# EAGLE design ControllerV1 (EAGLE 5.06)
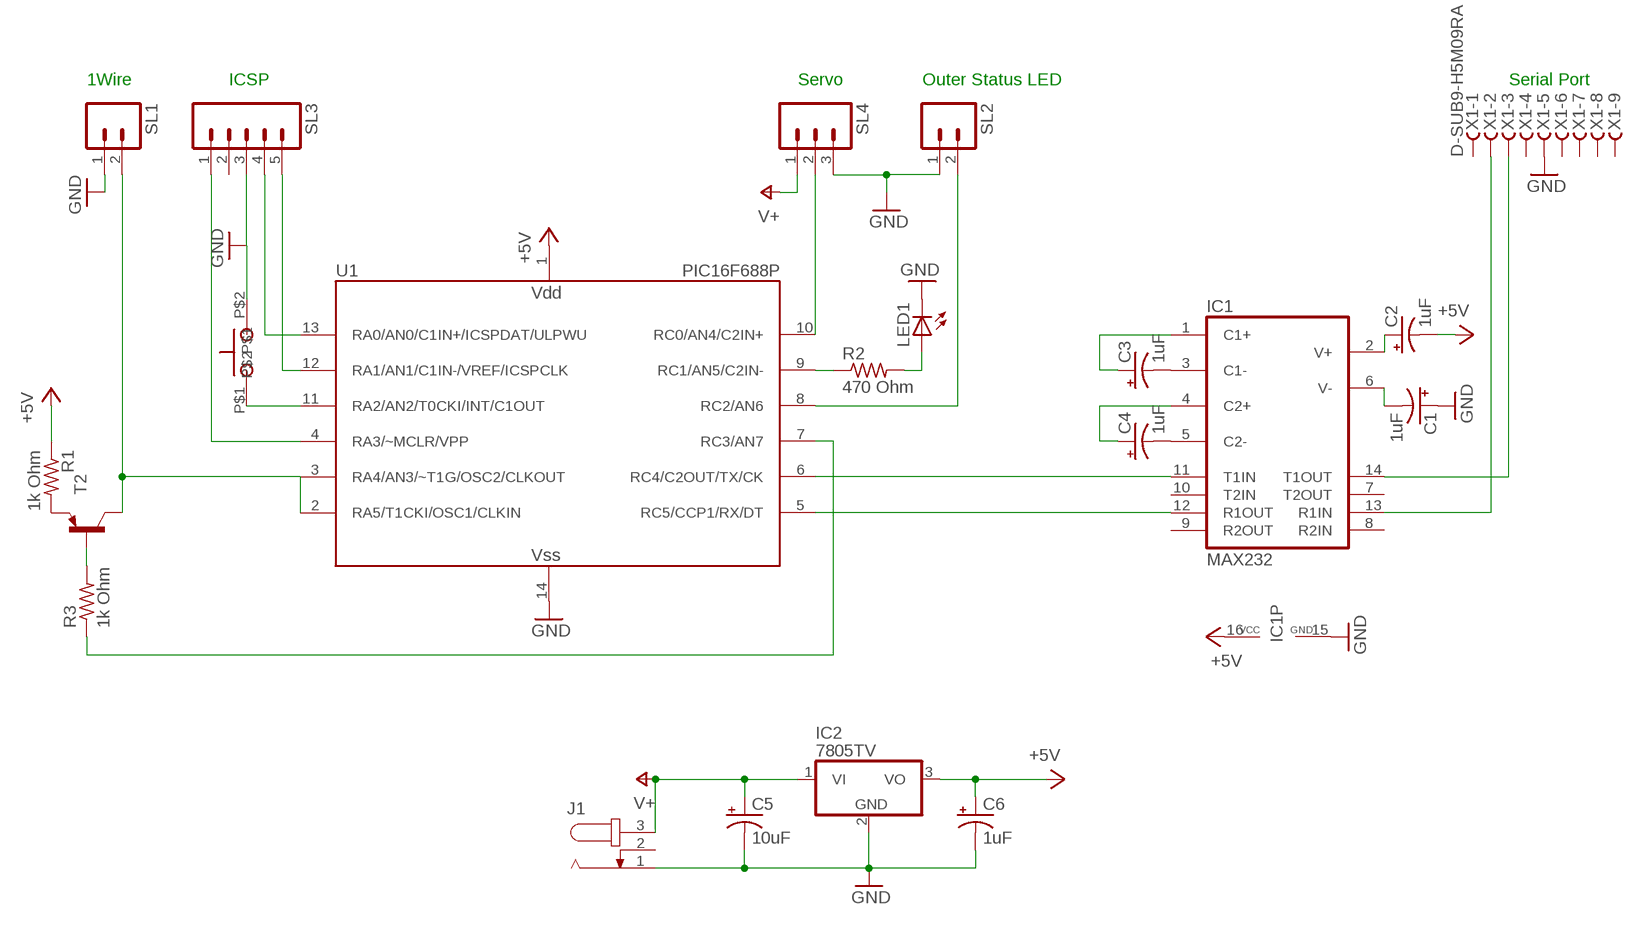
[diagram p0: schematic, sheet 1]

## Parts
C1  1uF  CPOL-USE2.5-5  [E2,5-5]
C2  1uF  CPOL-USE2.5-5  [E2,5-5]
C3  1uF  CPOL-USE2.5-5  [E2,5-5]
C4  1uF  CPOL-USE2.5-5  [E2,5-5]
C5  10uF  CPOL-USE2.5-5  [E2,5-5]
C6  1uF  CPOL-USE2.5-5  [E2,5-5]
IC1  MAX232  [DIL16]
IC2  7805TV  [TO220V]
J1  JACK-PLUG1  [SPC4078]
LED1  LED5MM  [LED5MM]
R1  1k Ohm  R-US_0207/10  [0207/10]
R2  470 Ohm  R-US_0207/10  [0207/10]
R3  1k Ohm  R-US_0207/10  [0207/10]
SL1  M02  [02P]
SL2  M02  [02P]
SL3  M05  [05P]
SL4  M03  [03P]
T2  BC327-16-PNP-TO92-EBC  [TO92-EBC]
U1  PIC16F688P  [DIP-14]
U$1  SWITCH  [SWITCH]
X1  D-SUB9-H5M09RA  [H5M09RA]

## Nets
+5V: C2.- C6.+ IC1.16(VCC) IC2.3(VO) R1.1 U1.1(VDD)
GND: C1.+ C5.- C6.- IC1.15(GND) IC2.2(GND) J1.1 LED1.K(C) SL1.1 SL2.1 SL3.3 SL4.3 U1.14(VSS) U$1.P$2 X1.5
N$1: R1.2 T2.E
N$2: R2.1 U1.9(RC1/AN5/C2IN-)
N$3: SL2.2 U1.8(RC2/AN6)
N$4: IC1.12(R1OUT) U1.5(RC5/CCP1/RX/DT)
N$5: IC1.11(T1IN) U1.6(RC4/C2OUT/TX/CK)
N$6: SL3.1 U1.4(RA3/~MCLR/VPP)
N$7: SL3.4 U1.13(RA0/AN0/C1IN+/ICSPDAT/ULPWU)
N$8: SL3.5 U1.12(RA1/AN1/C1IN-/VREF/ICSPCLK)
N$9: LED1.A R2.2
N$10: U1.11(RA2/AN2/T0CKI/INT/C1OUT) U$1.P$1
N$11: IC1.13(R1IN) X1.2
N$12: IC1.14(T1OUT) X1.3
N$13: C2.+ IC1.2(V+)
N$14: C1.- IC1.6(V-)
N$15: C4.- IC1.5(C2-)
N$16: C3.- IC1.3(C1-)
N$17: C4.+ IC1.4(C2+)
N$18: C3.+ IC1.1(C1+)
N$19: SL4.2 U1.10(RC0/AN4/C2IN+)
N$20: R3.1 U1.7(RC3/AN7)
N$21: SL1.2 T2.C U1.2(RA5/T1CKI/OSC1/CLKIN) U1.3(RA4/AN3/~T1G/OSC2/CLKOUT)
N$22: R3.2 T2.B
V+: C5.+ IC2.1(VI) J1.3 SL4.1
Unconnected: IC1.7(T2OUT) IC1.8(R2IN) IC1.9(R2OUT) IC1.10(T2IN) J1.2 SL3.2 X1.1 X1.4 X1.6 X1.7 X1.8 X1.9

## Notes on the sheet
- 1Wire | ICSP | Servo | Outer Status LED | Serial Port

## Library data of the parts
C1-C6 = resistor:CPOL-US: POLARIZED CAPACITOR, American symbol
IC1 = maxim:MAX232: RS232 TRANSEIVER
IC2 = linear:78*: Positive VOLTAGE REGULATOR Source: http://cache.national.com/ds/LM/LM78L05.pdf http://www.fairchildsemi.com/ds/LM/LM7805.pdf
J1 = con-jack:JACK-PLUG: DC POWER JACK Power Jack, DC, Right Angle, Through Hole, Rated 5A at 16VDC, PC Terminals Distributor: Farnell (www.Farnell.de) Drawing: 84N1161.pdf / 84N1162.pdf Manufacturer: SPC Technology (www.spctechnology.com) Type: SPC4077 / SPC 4078
LED1 = led:LED: LED OSRAM: - CHIPLED LG R971, LG N971, LY N971, LG Q971, LY Q971, LO R971, LY R971 LH N974, LH R974 LS Q976, LO Q976, LY Q976 LO Q996 - Hyper CHIPLED LW Q18S LB Q993, LB Q99A, LB R99A - SideLED LS A670, LO A670, LY A670, LG A670, LP A670 LB A673, LV A673, LT A673, LW A673 LH A674 LY A675 LS A676, LA A676, LO A676, LY A676, LW A676 LS A679, LY A679, LG A679 - Hyper Micro SIDELED® LS Y876, LA Y876, LO Y876, LY Y876 LT Y87S - SmartLED LW L88C, LW L88S LB L89C, LB L89S, LG L890 LS L89K, LO L89K, LY L89K LS L896, LA L896, LO L896, LY L896 - TOPLED LS T670, LO T670, LY T670, LG T670, LP T670 LSG T670, LSP T670, LSY T670, LOP T670, LYG T670 LG T671, LOG T671, LSG T671 LB T673, LV T673, LT T673, LW T673 LH T674 LS T676, LA T676, LO T676, LY T676, LB T676, LH T676, LSB T676, LW T676 LB T67C, LV T67C, LT T67C, LS T67K, LO T67K, LY T67K, LW E67C LS E67B, LA E67B, LO E67B, LY E67B, LB E67C, LV E67C, LT E67C LW T67C LS T679, LY T679, LG T679 LS T770, LO T770, LY T770, LG T770, LP T770 LB T773, LV T773, LT T773, LW T773 LH T774 LS E675, LA E675, LY E675, LS T675 LS T776, LA T776, LO T776, LY T776, LB T776 LHGB T686 LT T68C, LB T68C - Hyper Mini TOPLED® LB M676 - Mini TOPLED Santana® LG M470 LS M47K, LO M47K, LY M47K Source: http://www.osram.convergy.de LUXEON: - LUMILED® LXK2-PW12-R00, LXK2-PW12-S00, LXK2-PW14-U00, LXK2-PW14-V00 LXK2-PM12-R00, LXK2-PM12-S00, LXK2-PM14-U00 LXK2-PE12-Q00, LXK2-PE12-R00, LXK2-PE12-S00, LXK2-PE14-T00, LXK2-PE14-U00 LXK2-PB12-K00, LXK2-PB12-L00, LXK2-PB12-M00, LXK2-PB14-N00, LXK2-PB14-P00, LXK2-PB14-Q00 LXK2-PR12-L00, LXK2-PR12-M00, LXK2-PR14-Q00, LXK2-PR14-R00 LXK2-PD12-Q00, LXK2-PD12-R00, LXK2-PD12-S00 LXK2-PH12-R00, LXK2-PH12-S00 LXK2-PL12-P00, LXK2-PL12-Q00, LXK2-PL12-R00 Source: www.luxeon.com KINGBRIGHT: KA-3528ASYC Source: www.kingbright.com
R1-R3 = resistor:R-US_: RESISTOR, American symbol
SL1 SL2 = con-amp-quick:M02: AMP QUICK CONNECTOR
SL3 = con-amp-quick:M05: AMP QUICK CONNECTOR
SL4 = con-amp-quick:M03: AMP QUICK CONNECTOR
T2 = transistor:*-PNP-: PNP Transistror
U1 = microchip2:PIC16F688: Microchip PIC16F688 14-pin 8-bit Flash microcontroller with nanoWatt Technology 4096 words program memory, 256 bytes RAM, 256 bytes EEPROM 12 I/O, 8 10-bit A/D, 2 comparators, 1 8-bit timer, 1 16-bit timer, ULPWU, EUSART
U$1 = button:SWITCH
X1 = con-thomas-betts:D-SUB9-: D-Subminiatur Connector Source: Electronioc Interconnects European Edition 1998

## Board
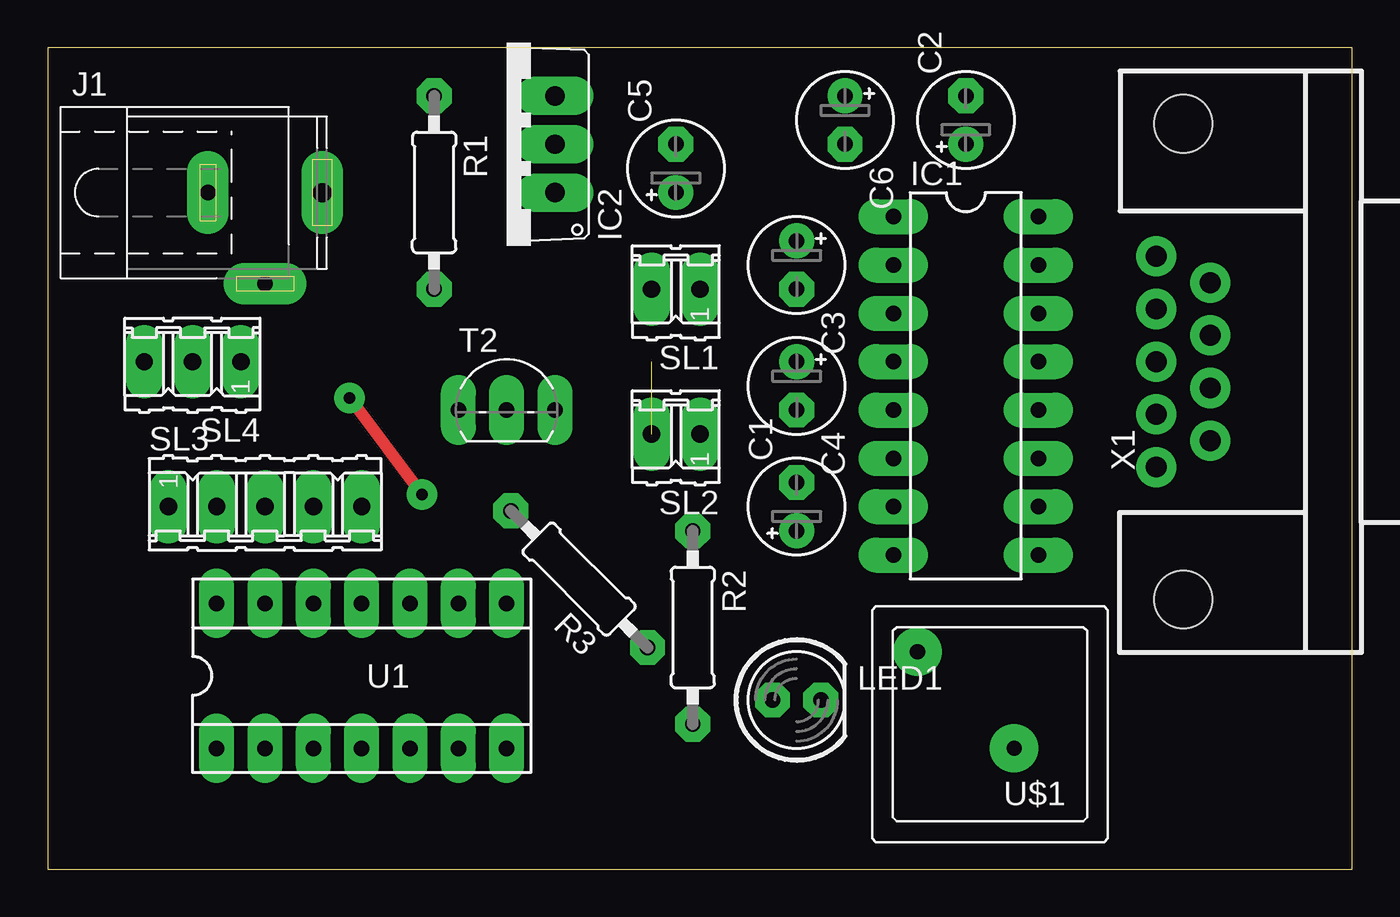
[diagram p1: board, top side]
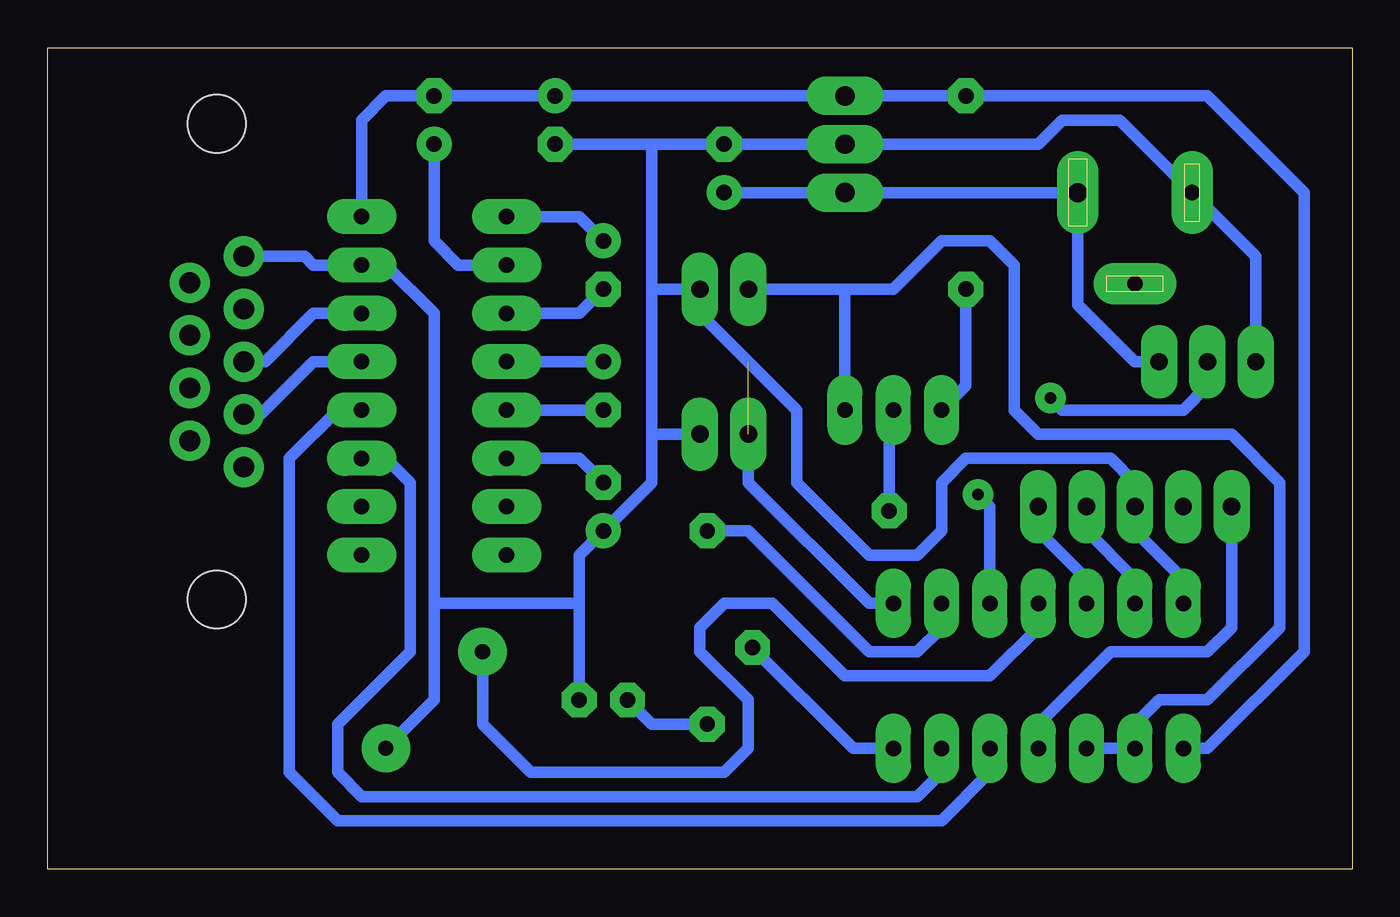
[diagram p2: board, bottom side, seen from below]

Size 68.58 x 43.18 mm. Coordinates in mm from the lower left corner, seen from the top.
Outline: 68.58,0 68.58,43.18 0,43.18 0,0 68.58,0
Copper layers (1*16): Top 0.035mm / dielectric 1.5mm / Bottom 0.035mm
Design rules "default *": minimum track width 24mil, minimum drill 24mil, track to track 8mil, track to pad 8mil, pad to pad 8mil, via to via 8mil, smd to smd 8mil, copper to edge 40mil, drill to drill 8mil, minimum pad ring 20mil, minimum via ring 20mil, stop-mask expansion 4mil, vias tented up to drill 0mil, thermal gap 10mil

### Footprints (pad centres in the part's own frame; a part is rotated, then mirrored left to right if it is on the bottom)
E2,5-5 = drill 0.813 pad 1.6 round: + -1.27,0 | drill 0.813 pad 1.6 octagon: - 1.27,0
DIL16 = drill 0.813 long: 1 -8.89,-3.81; 2 -6.35,-3.81; 3 -3.81,-3.81; 4 -1.27,-3.81; 5 1.27,-3.81; 6 3.81,-3.81; 7 6.35,-3.81; 8 8.89,-3.81; 9 8.89,3.81; 10 6.35,3.81; 11 3.81,3.81; 12 1.27,3.81; 13 -1.27,3.81; 14 -3.81,3.81; 15 -6.35,3.81; 16 -8.89,3.81
TO220V = drill 1.016 long: 1 -2.54,-2.54; 2 0,-2.54; 3 2.54,-2.54
SPC4078 = drill 0.8 pad 2.184 long: 1 -3,0; 2 0,-4.8 | drill 1 pad 2.184 long: 3 3,0
LED5MM = drill 0.813 octagon: A -1.27,0; K 1.27,0
0207/10 = drill 0.813 octagon: 1 -5.08,0; 2 5.08,0
02P = drill 0.914 long: 1 -1.27,0; 2 1.27,0
05P = drill 0.914 long: 1 -5.08,0; 2 -2.54,0; 3 0,0; 4 2.54,0; 5 5.08,0
03P = drill 0.914 long: 1 -2.54,0; 2 0,0; 3 2.54,0
TO92-EBC = drill 0.813 long: B 0,-1.27; C 2.54,-1.27; E -2.54,-1.27
DIP-14 = drill 0.813 pad 1.6 long: 1 -3.81,7.62; 2 -3.81,5.08; 3 -3.81,2.54; 4 -3.81,0; 5 -3.81,-2.54; 6 -3.81,-5.08; 7 -3.81,-7.62; 8 3.81,-7.62; 9 3.81,-5.08; 10 3.81,-2.54; 11 3.81,0; 12 3.81,2.54; 13 3.81,5.08; 14 3.81,7.62
SWITCH = drill 0.8 pad 2.54 round: P$1 3.81,-3.81; P$2 -1.27,1.27
H5M09RA = drill 1.092 round: 1 -5.537,1.422; 2 -2.769,1.422; 3 0,1.422; 4 2.769,1.422; 5 5.537,1.422; 6 -4.153,-1.422; 7 -1.384,-1.422; 8 1.384,-1.422; 9 4.153,-1.422 | hole 3.048: -12.497,0; 12.497,0

### Placement (x,y rotation side)
C1  39.37,19.05 90 top
C2  48.26,39.37 90 top
C3  39.37,31.75 270 top
C4  39.37,25.4 270 top
C5  33.02,36.83 90 top
C6  41.91,39.37 270 top
IC1  48.26,25.4 270 top
IC2  24.13,38.1 90 top
J1  11.43,35.56 0 top
LED1  39.37,8.89 0 top
R1  20.32,35.56 270 top
R2  33.91,12.7 270 top
R3  27.94,15.24 135 top
SL1  33.02,30.48 180 top
SL2  33.02,22.86 180 top
SL3  11.43,19.05 0 top
SL4  7.62,26.67 180 top
T2  24.13,25.4 0 top
U1  16.51,10.16 90 top
U$1  49.53,7.62 180 top
X1  59.69,26.67 90 top

### Tracks (layer width: path | path; a pad name or v marks a point on that pad's centre or on a via)
+5V
  Bottom 0.61: 44.45,40.64 IC2.3 R1.1 7.62,40.64 2.54,35.56 2.54,11.43 7.62,6.35 U1.1 | IC1.16 52.07,39.37 50.8,40.64 C2.- 44.45,40.64 | 44.45,40.64 C6.+
GND
  Bottom 0.61: 36.83,38.1 C6.- | 36.83,38.1 C5.- IC2.2 16.51,38.1 15.24,39.37 12.24,39.37 J1.1 5.08,32.21 SL4.3 | 36.83,30.48 36.83,38.1 | 36.83,30.48 36.83,22.86 | 40.64,16.51 40.64,13.97 | 40.64,13.97 48.26,13.97 | 48.26,13.97 48.26,29.21 50.8,31.75 IC1.15 54.61,31.75 55.07,32.21 X1.5 | 36.83,22.86 36.83,20.32 40.64,16.51 | 40.64,16.51 C1.+ | 36.83,22.86 SL2.1 | U$1.P$2 48.26,8.89 48.26,13.97 | 40.64,13.97 LED1.K | U1.14 8.89,15.24 11.43,17.78 SL3.3 11.43,20.32 12.7,21.59 20.32,21.59 21.59,20.32 21.59,17.78 22.86,16.51 25.4,16.51 29.21,20.32 29.21,24.13 34.29,29.21 SL1.1 36.83,30.48
N$1
  Bottom 0.61: R1.2 20.32,25.4 T2.E
N$2
  Bottom 0.61: U1.9 21.59,12.7 22.86,11.43 25.4,11.43 31.75,17.78 R2.1
N$3  (1 unrouted)
  Bottom 0.61: U1.8 25.4,13.97 31.75,20.32 SL2.2
N$4
  Bottom 0.61: U1.5 19.05,5.08 21.59,2.54 53.34,2.54 55.88,5.08 55.88,21.59 53.34,24.13 IC1.12
N$5
  Bottom 0.61: U1.6 21.59,5.08 22.86,3.81 52.07,3.81 53.34,5.08 53.34,7.62 49.53,11.43 49.53,20.32 50.8,21.59 IC1.11
N$6
  Bottom 0.61: U1.4 16.51,7.62 12.7,11.43 7.62,11.43 6.35,12.7 SL3.1
N$7
  Bottom 0.61: U1.13 11.43,15.24 13.97,17.78 SL3.4
N$8
  Bottom 0.61: U1.12 13.97,15.24 16.51,17.78 SL3.5
N$9
  Bottom 0.61: R2.2 36.83,7.62 LED1.A
N$10
  Bottom 0.61: U$1.P$1 45.72,7.62 43.18,5.08 33.02,5.08 31.75,6.35 31.75,8.89 34.29,11.43 34.29,12.7 33.02,13.97 30.48,13.97 26.67,10.16 19.05,10.16 16.51,12.7 U1.11
N$11
  Bottom 0.61: X1.2 57.38,23.9 54.61,26.67 IC1.13
N$12
  Bottom 0.61: X1.3 57.15,26.67 54.61,29.21 IC1.14
N$13
  Bottom 0.61: IC1.2 46.99,31.75 48.26,33.02 C2.+
N$14
  Bottom 0.61: IC1.6 40.64,21.59 C1.-
N$15
  Bottom 0.61: C4.- IC1.5
N$16
  Bottom 0.61: IC1.3 40.64,29.21 C3.-
N$17
  Bottom 0.61: C4.+ IC1.4
N$18
  Bottom 0.61: C3.+ 40.64,34.29 IC1.1
N$19  (via drill 0.6)
  Top 0.61: v15.88,24.77 v19.68,19.68
  Bottom 0.61: SL4.2 7.62,25.4 8.89,24.13 15.24,24.13 v15.88,24.77 | v19.68,19.68 19.05,19.05 U1.10
N$20
  Bottom 0.61: U1.7 26.23,6.35 R3.1
N$21
  Bottom 0.61: U1.3 U1.2 11.43,7.62 10.16,8.89 7.62,8.89 3.81,12.7 3.81,20.32 6.35,22.86 16.51,22.86 17.78,24.13 17.78,31.75 19.05,33.02 21.59,33.02 24.13,30.48 26.67,30.48 | 26.67,30.48 T2.C | 26.67,30.48 SL1.2
N$22
  Bottom 0.61: R3.2 24.35,23.91 T2.B
V+
  Bottom 0.61: C5.+ IC2.1 J1.3 14.43,29.67 11.43,26.67 SL4.1